# EAGLE design Fensterkontakt5 (EAGLE 7.5.0)
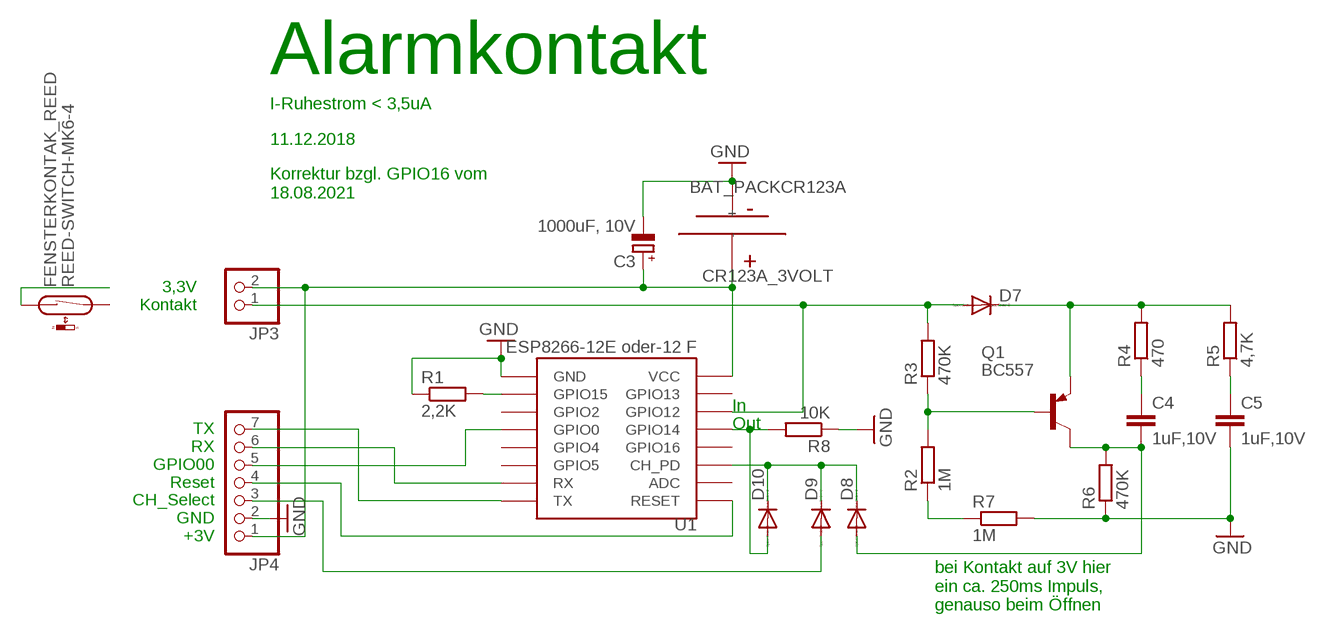
[diagram p0: schematic, sheet 1]

## Parts
C3  1000uF, 10V  CPOL-EUE5-4  [E5-4]
C4  1uF,10V  C-EU075-032X103  [C075-032X103]
C5  1uF,10V  C-EU075-032X103  [C075-032X103]
CR123A_3VOLT  BAT_PACKCR123A  [BH123A]
D7  DIODE-D-7.5  [D-7.5]
D8  DIODE-D-7.5  [D-7.5]
D9  DIODE-D-7.5  [D-7.5]
D10  DIODE-D-7.5  [D-7.5]
FENSTERKONTAK_REED  REED-SWITCH-MK6-4  [MK6-4]
JP3  PINHD-1X2  [1X02]
JP4  PINHD-1X7  [1X07]
Q1  BC557  [TO92-EBC]
R1  2,2K  R-EU_0207/7  [0207/7]
R2  1M  R-EU_0207/7  [0207/7]
R3  470K  R-EU_0207/7  [0207/7]
R4  470  R-EU_0207/7  [0207/7]
R5  4,7K  R-EU_0207/7  [0207/7]
R6  470K  R-EU_0207/7  [0207/7]
R7  1M  R-EU_0207/7  [0207/7]
R8  10K  R-EU_0207/7  [0207/7]
U1  ESP8266-12E oder-12 F  ESP12  [ESP12]

## Nets
GND: C3.- C5.2 CR123A_3VOLT.- JP4.2 R1.1 R6.1 R7.2 R8.1 U1.GND
N$1: C4.2 D8.A Q1.C R6.2
N$2: D7.C Q1.E R4.2 R5.2
N$3: C5.1 R5.1
N$4: JP4.7 U1.TX
N$5: Q1.B R2.2 R3.1
N$6: D8.C D9.C D10.C U1.CH_PD
N$7: C4.1 R4.1
N$8: FENSTERKONTAK_REED.1
N$9: D10.A R8.2 U1.GPIO14
N$10: JP4.6 U1.RX
N$11: D7.A JP3.1 R3.2 U1.GPIO12
N$12: R1.2 U1.GPIO15
N$14: JP4.4 U1.RESET
N$15: D9.A JP4.3
N$18: C3.+ CR123A_3VOLT.+ JP3.2 JP4.1 U1.VCC
N$19: R2.1 R7.1
N$25: JP4.5 U1.GPIO0
Unconnected: FENSTERKONTAK_REED.2 U1.ADC U1.GPIO2 U1.GPIO4 U1.GPIO5 U1.GPIO13 U1.GPIO16

## Notes on the sheet
- Alarmkontakt
- I-Ruhestrom < 3,5uA
- 11.12.2018
- Korrektur bzgl. GPIO16 vom 
  18.08.2021
- 3,3V
  Kontakt
- In
- Out
- TX
  RX
  GPIO00
  Reset
  CH_Select
  GND
  +3V
- bei Kontakt auf 3V hier
  ein ca. 250ms Impuls,
  genauso beim Öffnen

## Library data of the parts
C3 = rcl:CPOL-EU: POLARIZED CAPACITOR, European symbol
C4 C5 = rcl:C-EU: CAPACITOR, European symbol
CR123A_3VOLT = batteries:BAT_PACK: collection of battery footprints; DIGIKEY: BH123A-ND; MANUFACTURER: MPD; MPN: BH123A
D7-D10 = diode:DIODE-: DIODE
FENSTERKONTAK_REED = switch-reed:REED-SWITCH-: Reed Sensor; OC_FARNELL: unknown
JP3 = pinhead:PINHD-1X2: PIN HEADER
JP4 = pinhead:PINHD-1X7: PIN HEADER
Q1 = transistor-pnp:BC557*: PNP Transistror
R1-R8 = rcl:R-EU_: RESISTOR, European symbol
U1 = esp8266modules:ESP12: ESP8266 Wifi module 12

## Board
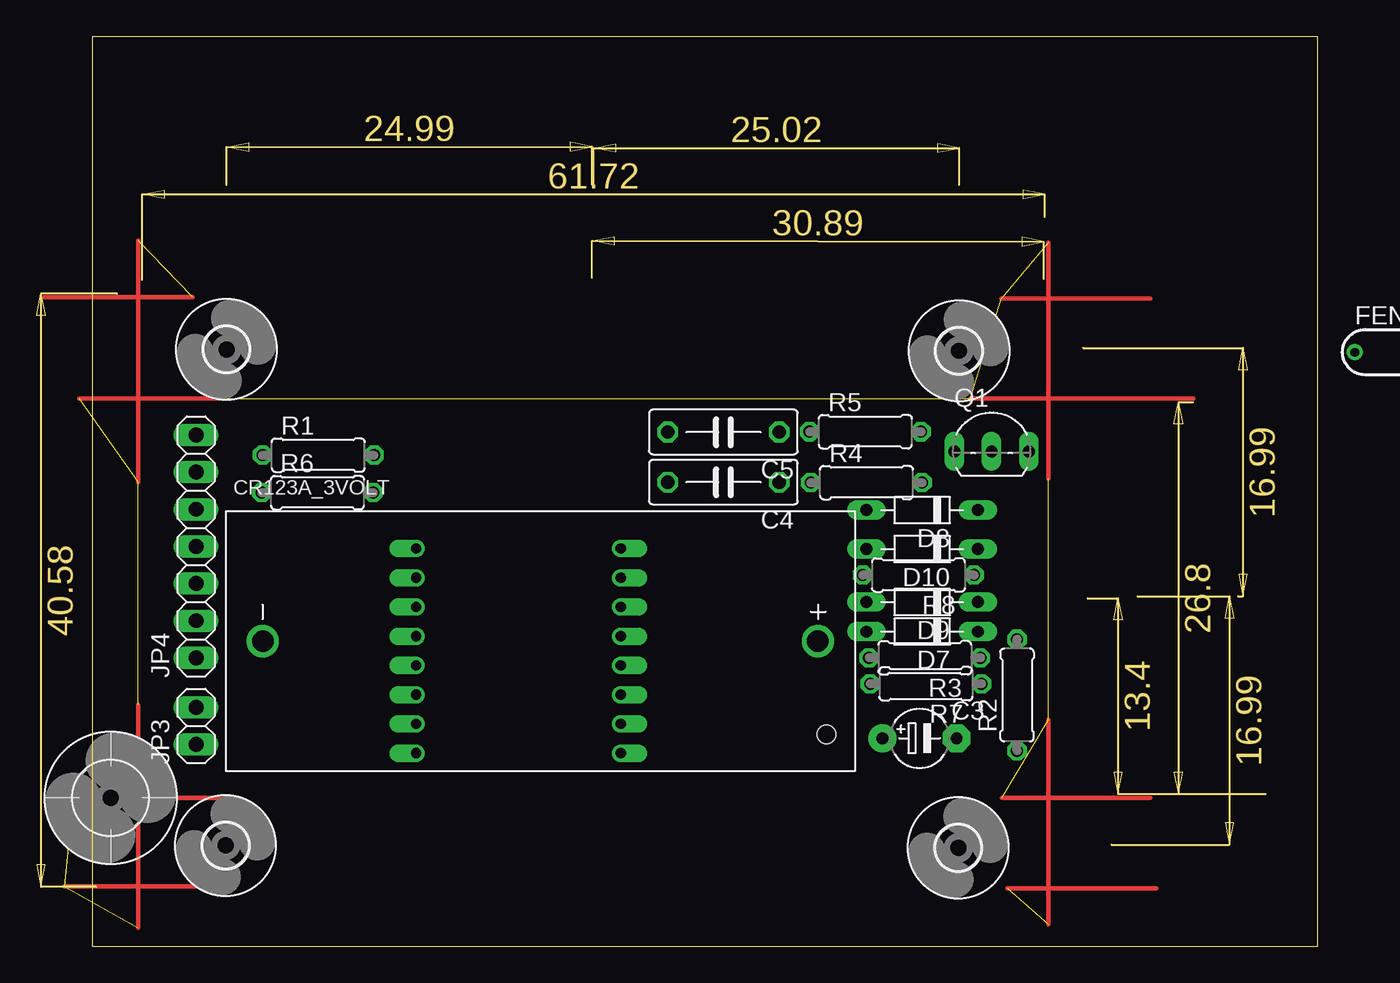
[diagram p1: board, top side]
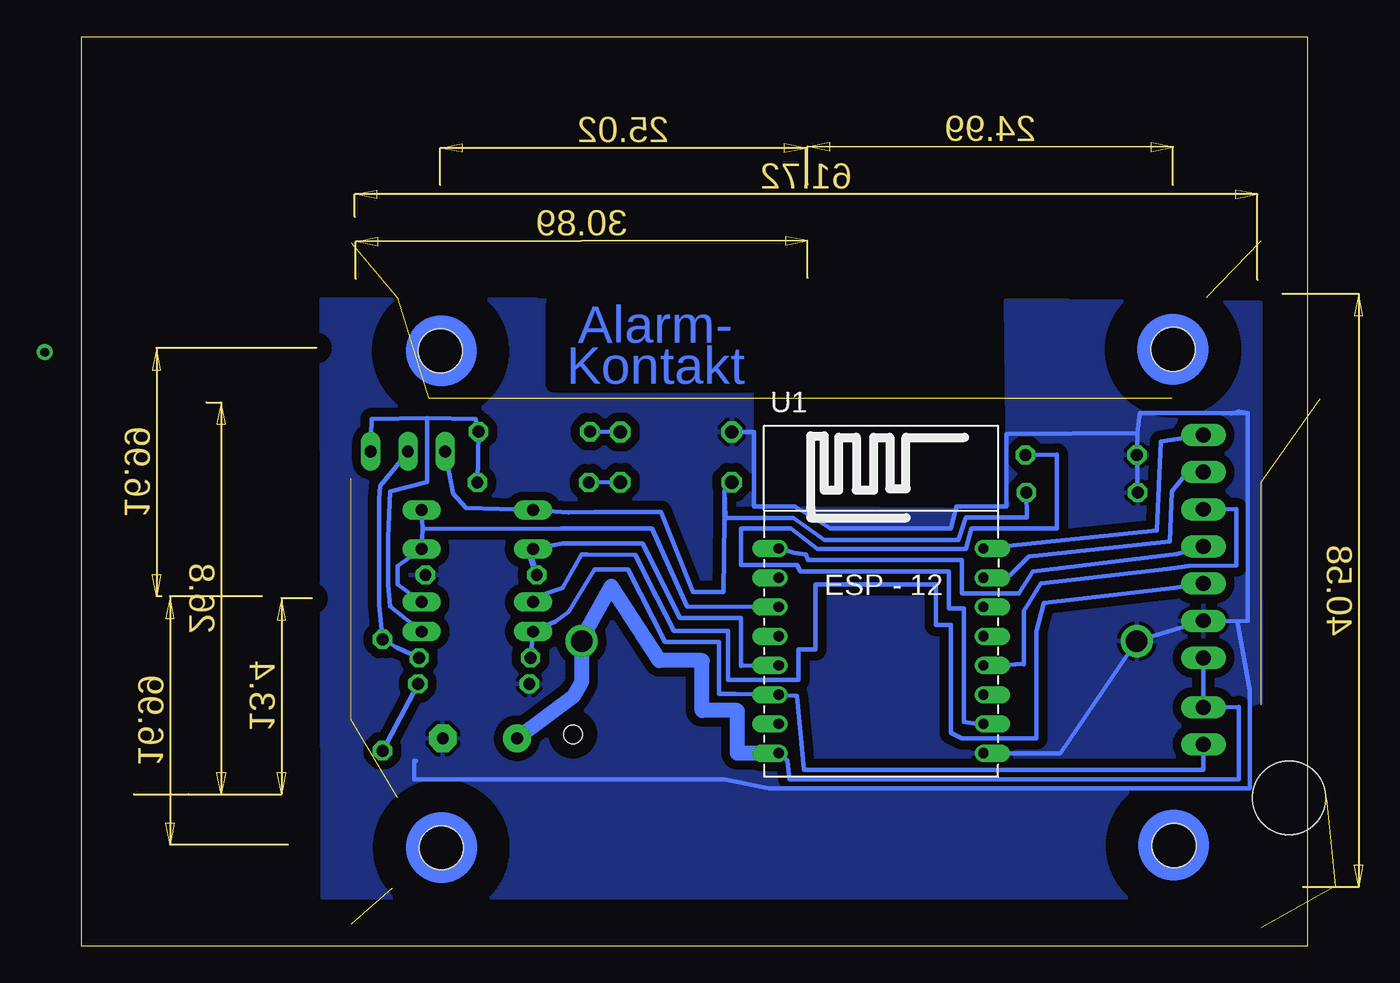
[diagram p2: board, bottom side, seen from below]

Size 83.82 x 62.23 mm. Coordinates in mm from the lower left corner, seen from the top.
Outline: 0,0 83.82,0 83.82,62.23 0,62.23 0,0
Copper layers (1*16): Top 0.035mm / dielectric 1.5mm / Bottom 0.035mm
Design rules "default": minimum track width 10mil, minimum drill 24mil, track to track 8mil, track to pad 8mil, pad to pad 8mil, via to via 8mil, smd to smd 8mil, copper to edge 40mil, drill to drill 8mil, minimum pad ring 10mil, minimum via ring 8mil, stop-mask expansion 4mil, vias tented up to drill 0mil, thermal gap 10mil

### Footprints (pad centres in the part's own frame; a part is rotated, then mirrored left to right if it is on the bottom)
E5-4 = drill 0.813 pad 1.905: + -2.54,0 | drill 0.813 pad 1.905 octagon: - 2.54,0
C075-032X103 = drill 0.914 octagon: 1 -3.81,0; 2 3.81,0
BH123A = drill 1.47: + 18.985,0; - -18.985,0 | hole 1.27: 19.58,-6.37
D-7.5 = drill 0.813 long: A 3.81,0; C -3.81,0
MK6-4 = drill 0.6 pad 1.016: 1 -5.08,0; 2 5.08,0
1X02 = drill 1.016 long: 1 -1.27,0; 2 1.27,0
1X07 = drill 1.016 long: 1 -7.62,0; 2 -5.08,0; 3 -2.54,0; 4 0,0; 5 2.54,0; 6 5.08,0; 7 7.62,0
TO92-EBC = drill 0.813 long: B 0,-1.27; C -2.54,-1.27; E 2.54,-1.27
0207/7 = drill 0.813 octagon: 1 -3.81,0; 2 3.81,0
ESP12 = drill 0.7 offset: ADC -7.1,3.8; CH_PD -7.1,1.8; GND 6.9,-8.2; GPIO0 6.9,-2.2; GPIO2 6.9,-4.2; GPIO4 6.9,1.8; GPIO5 6.9,-0.2; GPIO12 -7.1,-4.2; GPIO13 -7.1,-6.2; GPIO14 -7.1,-2.2; GPIO15 6.9,-6.2; GPIO16 -7.1,-0.2; RESET -7.1,5.8; RX 6.9,3.8; TX 6.9,5.8; VCC -7.1,-8.2
5,0 = hole 5: 0,0
3,0 = hole 3: 0,0

### Placement (x,y rotation side)
C3  56.59,14.24 0 top
C4  43.18,31.75 180 top
C5  43.18,35.18 180 top
CR123A_3VOLT  30.66,20.88 0 top
D7  56.77,21.53 180 top
D8  56.77,29.84 180 top
D9  56.77,23.56 180 top
D10  56.77,27.18 180 top
FENSTERKONTAK_REED  91.44,40.64 0 top
JP3  7.11,15.09 90 top
JP4  7.11,27.36 90 top
Q1  61.52,35.13 0 top
R1  15.47,33.6 0 top
R2  63.26,17.2 90 top
R3  56.95,19.74 180 top
R4  52.96,31.72 0 top
R5  52.88,35.2 0 top
R6  15.42,31.04 0 top
R7  57.02,17.96 180 top
R8  56.52,25.4 180 top
U1  29.06,21.41 0 bottom
U$1  [5,0]  1.27,10.16 0 top
U$2  [3,0]  9.13,6.9 0 top
U$3  [3,0]  59.24,6.74 0 top
U$4  [3,0]  59.29,40.74 0 top
U$5  [3,0]  9.19,40.84 0 top

### Tracks (layer width: path | path; a pad name or v marks a point on that pad's centre or on a via)
GND
  Bottom 0.305: R6.1 R1.1 11.63,35.11 | 60.96,12.7 61.09,12.7 61.09,11.43 39.88,11.43 36.83,10.79 3.94,10.79 3.94,17.53 4.81,22.23 | 4.81,22.23 JP4.2 CR123A_3VOLT.- 16.89,13.21 U1.GND | 4.81,22.23 4.1,22.26 4.1,36.48 | 5.21,36.45 4.7,36.58 4.1,36.48 | 11.63,35.11 11.47,36.47 4.1,36.48 | C5.2 37.85,35.18 37.85,30.1 35.05,30.1 32.64,28.57 24.38,28.57 24,30.1 20.57,30.1 20.57,35.05 11.63,35.11
  pour Bottom (isolate 0.61): 3.24,44.04 20.64,44.16 20.45,29.84 38.1,29.97 37.94,44.16 67.41,44.23 67.34,3.37 3.21,3.37
N$1
  Bottom 0.305: 39.81,29.31 39.88,29.21 39.94,24.26 42.04,24.26 44.2,29.72 48.77,29.72 50.55,29.68 D8.A 57.53,29.97 58.42,30.99 Q1.C | 39.81,29.31 39.87,31.18 | 39.87,31.18 C4.2 | R6.2 19.18,29.34 23.37,29.34 23.88,27.81 33.02,27.81 35.15,29.3 39.81,29.31 | 39.88,29.34 39.87,31.18
N$2
  Bottom 0.305: R4.2 R5.2 | R5.2 56.64,35.31 | D7.C 62.74,23.24 62.87,24.77 62.87,27.94 62.74,31.11 60.2,31.75 60.21,36.13 | Q1.E 64.01,36.07 60.21,36.13 | 60.21,36.13 56.9,36.07 R5.2
N$3
  Bottom 0.305: C5.1 R5.1
N$4
  Bottom 0.305: U1.TX 10.29,28.45 10.03,34.54 JP4.7
N$5
  Bottom 0.305: R3.1 62.29,20.45 R2.2 63.5,23.37 63.5,30.61 63.44,31.5 61.53,33.78 Q1.B
N$6
  Bottom 0.305: U1.CH_PD 42.42,23.24 44.83,28.57 51.05,28.57 60.52,28.57 | D8.C 60.52,28.57 | 60.52,28.57 D10.C 62.23,26.04 62.23,24.77 D9.C
N$7
  Bottom 0.305: C4.1 R4.1
N$9
  Bottom 0.305: D10.A 50.93,27.56 45.47,27.56 42.93,22.48 38.74,22.48 38.74,19.18 U1.GPIO14
  Bottom 0.406: D10.A 53.34,27.18 R8.2
N$10
  Bottom 0.305: JP4.6 8.26,32.39 9.27,31.11 9.4,27.69 19.05,26.67 20.32,25.4 U1.RX
N$11
  Bottom 0.305: JP3.1 7.11,12.06 34.42,12.06 34.93,17.14 U1.GPIO12 39.12,17.27 40.26,17.27 40.26,20.83 43.94,20.83 46.48,25.78 48.77,25.78 50.55,22.86 51.44,22.23 D7.A R3.2
N$12
  Bottom 0.305: R1.2 17.14,33.66 17.14,28.57 22.99,28.57 23.37,27.18 33.53,27.18 35.31,28.57 38.74,28.57 38.74,26.1 34.93,26.1 34.67,25.65 24.51,25.65 24.51,23.11 23.5,23.11 23.5,15.37 22.86,15.24 U1.GPIO15
N$14
  Bottom 0.305: JP4.4 8.89,26.83 18.8,25.65 19.75,24.13 23.62,24.13 23.62,26.42 34.16,26.42 34.29,26.8 35.05,26.92 U1.RESET
N$15
  Bottom 0.305: JP4.3 9.14,24.51 18.03,23.5 18.54,21.53 18.54,14.22 23.62,14.22 24.38,14.61 24.38,21.97 25.4,21.97 25.4,24.77 33.66,24.77 33.66,20.32 34.8,20.32 34.8,18.23 39.62,18.23 39.62,21.59 43.31,21.59 45.09,25.02 45.94,26.76 49.28,26.8 49.66,26.8 50.93,24.51 52.07,24.13 D9.A
N$18
  Bottom 0.305: JP4.1 JP3.2 4.7,16.38 4.7,11.43 35.43,11.43 35.56,12.7 U1.VCC
  Bottom 1.016: U1.VCC 38.99,13.21 38.99,16.13 41.4,16.13 41.4,19.56 44.32,19.56 47.62,24.64 49.4,21.46 CR123A_3VOLT.+ 49.66,18.03 50.17,17.14 C3.+
N$19
  Bottom 0.305: R7.1 R2.1
N$23  (11 unrouted)
  Top 0.305: -1.27,10.16 8.89,10.16 | 3.17,16.51 3.17,1.27 | -0.89,37.47 9.27,37.47 | 60.07,37.47 75.31,37.47 | 62.23,10.16 72.39,10.16 | 65.41,15.49 65.41,1.52 | 65.41,48.13 65.41,32 | 3.17,48.26 3.17,31.75 | -3.27,44.42 6.89,44.42 | 62.2,44.32 72.36,44.32 | 62.61,3.97 72.77,3.97 | -1.9,4.1 8.26,4.1
N$25
  Bottom 0.305: U1.GPIO0 19.97,19.27 19.59,19.3 19.4,19.27 19.4,22.95 18.22,24.83 9.59,25.81 8.13,26.04 4.86,26.07 4.86,29.91 JP4.5
(copper drawn outside any net)
  shapes: Bottom circle x4

### Text on the board
Bottom: Alarm- / Kontakt